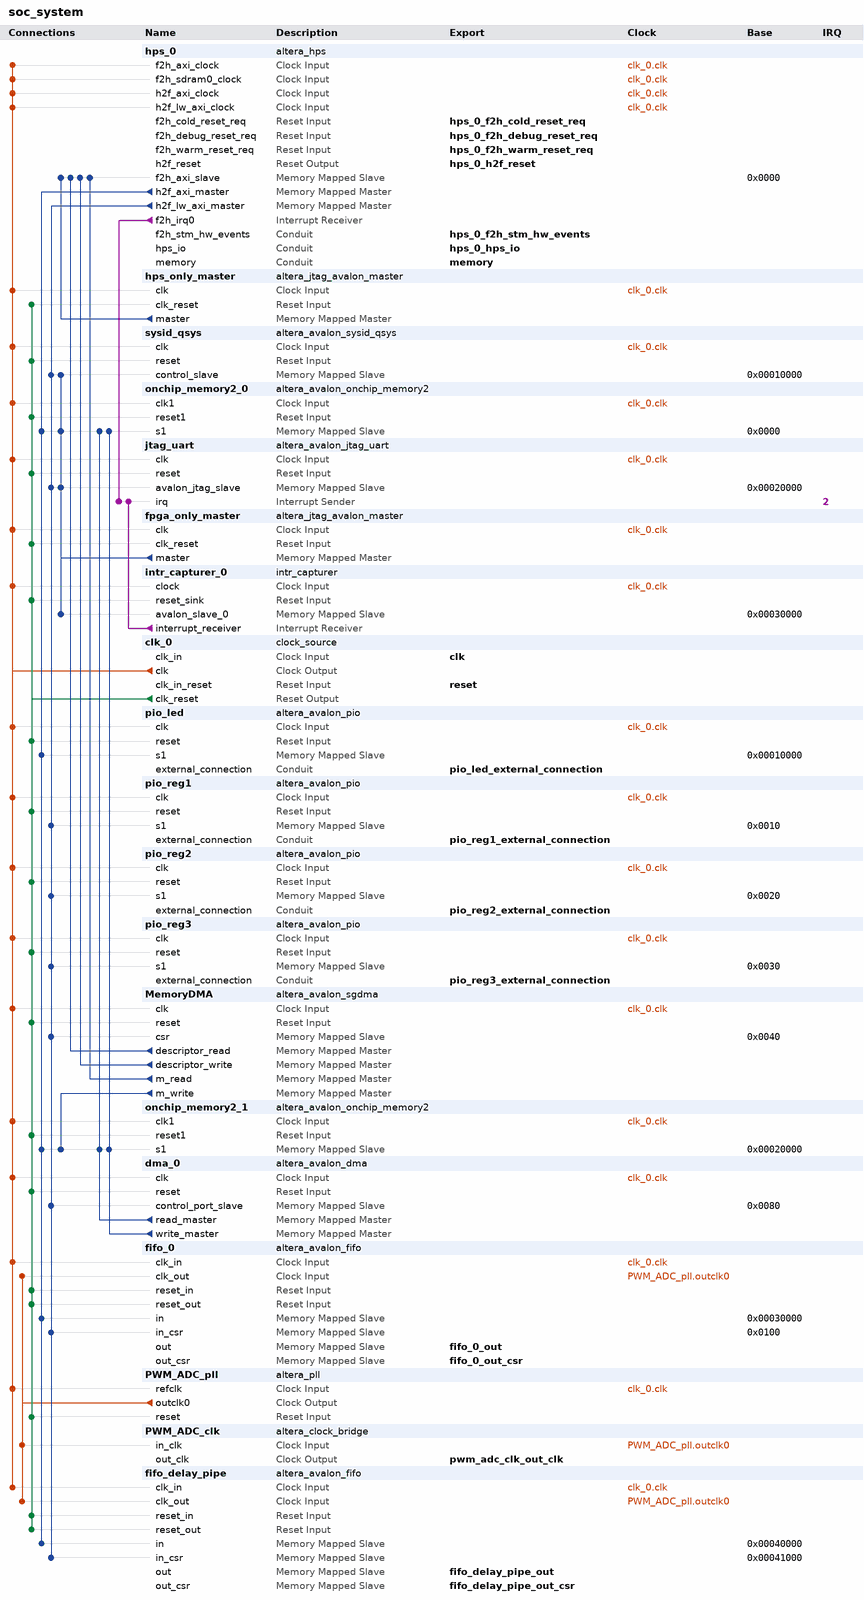
[diagram p0: system contents]
# Platform Designer (Qsys) system soc_system, Cyclone V 5CSEMA4U23C6
# Parameters at their usual value, and those the tool derives, are not listed.
package require -exact qsys 15.0
create_system soc_system
set_project_property DEVICE_FAMILY {Cyclone V}
set_project_property DEVICE 5CSEMA4U23C6

add_instance hps_0 altera_hps 15.0
set_instance_parameter_value hps_0 EMAC1_Mode RGMII
set_instance_parameter_value hps_0 EMAC1_PinMuxing {HPS I/O Set 0}
set_instance_parameter_value hps_0 F2SCLK_COLDRST_Enable true
set_instance_parameter_value hps_0 F2SCLK_DBGRST_Enable true
set_instance_parameter_value hps_0 F2SCLK_WARMRST_Enable true
set_instance_parameter_value hps_0 F2SDRAM_Type AXI-3
set_instance_parameter_value hps_0 F2SDRAM_Width 64
set_instance_parameter_value hps_0 F2SINTERRUPT_Enable true
set_instance_parameter_value hps_0 F2S_Width 2
set_instance_parameter_value hps_0 FPGA_PERIPHERAL_OUTPUT_CLOCK_FREQ_EMAC0_GTX_CLK 100
set_instance_parameter_value hps_0 FPGA_PERIPHERAL_OUTPUT_CLOCK_FREQ_EMAC0_MD_CLK 100.0
set_instance_parameter_value hps_0 FPGA_PERIPHERAL_OUTPUT_CLOCK_FREQ_EMAC1_GTX_CLK 100
set_instance_parameter_value hps_0 FPGA_PERIPHERAL_OUTPUT_CLOCK_FREQ_EMAC1_MD_CLK 100.0
set_instance_parameter_value hps_0 HPS_PROTOCOL DDR3
set_instance_parameter_value hps_0 I2C0_Mode I2C
set_instance_parameter_value hps_0 I2C0_PinMuxing {HPS I/O Set 0}
set_instance_parameter_value hps_0 I2C1_Mode I2C
set_instance_parameter_value hps_0 I2C1_PinMuxing {HPS I/O Set 0}
set_instance_parameter_value hps_0 LWH2F_Enable true
set_instance_parameter_value hps_0 MEM_BANKADDR_WIDTH 3
set_instance_parameter_value hps_0 MEM_CLK_FREQ 400.0
set_instance_parameter_value hps_0 MEM_COL_ADDR_WIDTH 10
set_instance_parameter_value hps_0 MEM_DQ_WIDTH 32
set_instance_parameter_value hps_0 MEM_DRV_STR RZQ/6
set_instance_parameter_value hps_0 MEM_ROW_ADDR_WIDTH 15
set_instance_parameter_value hps_0 MEM_RTT_NOM RZQ/6
set_instance_parameter_value hps_0 MEM_RTT_WR {Dynamic ODT off}
set_instance_parameter_value hps_0 MEM_TCL 7
set_instance_parameter_value hps_0 MEM_TFAW_NS 37.5
set_instance_parameter_value hps_0 MEM_TRAS_NS 35.0
set_instance_parameter_value hps_0 MEM_TRCD_NS 13.75
set_instance_parameter_value hps_0 MEM_TRFC_NS 300.0
set_instance_parameter_value hps_0 MEM_TRP_NS 13.75
set_instance_parameter_value hps_0 MEM_VENDOR Other
set_instance_parameter_value hps_0 MEM_WTCL 7
set_instance_parameter_value hps_0 QSPI_Mode N/A
set_instance_parameter_value hps_0 QSPI_PinMuxing Unused
set_instance_parameter_value hps_0 REF_CLK_FREQ 25.0
set_instance_parameter_value hps_0 S2F_Width 2
set_instance_parameter_value hps_0 SDIO_Mode {4-bit Data}
set_instance_parameter_value hps_0 SDIO_PinMuxing {HPS I/O Set 0}
set_instance_parameter_value hps_0 SPIM1_Mode {Single Slave Select}
set_instance_parameter_value hps_0 SPIM1_PinMuxing {HPS I/O Set 0}
set_instance_parameter_value hps_0 STM_Enable true
set_instance_parameter_value hps_0 TIMING_BOARD_AC_SKEW 0.02
set_instance_parameter_value hps_0 TIMING_BOARD_AC_TO_CK_SKEW 0.0
set_instance_parameter_value hps_0 TIMING_BOARD_DQ_TO_DQS_SKEW 0.0
set_instance_parameter_value hps_0 TIMING_BOARD_MAX_CK_DELAY 0.6
set_instance_parameter_value hps_0 TIMING_BOARD_MAX_DQS_DELAY 0.6
set_instance_parameter_value hps_0 TIMING_BOARD_SKEW_BETWEEN_DQS 0.02
set_instance_parameter_value hps_0 TIMING_BOARD_SKEW_CKDQS_DIMM_MAX 0.01
set_instance_parameter_value hps_0 TIMING_BOARD_SKEW_CKDQS_DIMM_MIN -0.01
set_instance_parameter_value hps_0 TIMING_BOARD_SKEW_WITHIN_DQS 0.02
set_instance_parameter_value hps_0 TIMING_TDH 125
set_instance_parameter_value hps_0 TIMING_TDQSCK 400
set_instance_parameter_value hps_0 TIMING_TDQSQ 120
set_instance_parameter_value hps_0 TIMING_TDS 50
set_instance_parameter_value hps_0 TIMING_TIH 250
set_instance_parameter_value hps_0 TIMING_TIS 175
set_instance_parameter_value hps_0 TIMING_TQSH 0.38
set_instance_parameter_value hps_0 UART0_Mode {No Flow Control}
set_instance_parameter_value hps_0 UART0_PinMuxing {HPS I/O Set 0}
set_instance_parameter_value hps_0 USB1_Mode SDR
set_instance_parameter_value hps_0 USB1_PinMuxing {HPS I/O Set 0}
set_instance_parameter_value hps_0 desired_cfg_clk_mhz 100.0
set_instance_parameter_value hps_0 desired_qspi_clk_mhz 370.0

add_instance hps_only_master altera_jtag_avalon_master 15.0

add_instance sysid_qsys altera_avalon_sysid_qsys 15.0
set_instance_parameter_value sysid_qsys id -1395322110

add_instance onchip_memory2_0 altera_avalon_onchip_memory2 15.0
set_instance_parameter_value onchip_memory2_0 dataWidth 64
set_instance_parameter_value onchip_memory2_0 dualPort false
set_instance_parameter_value onchip_memory2_0 initMemContent true
set_instance_parameter_value onchip_memory2_0 initializationFileName onchip_memory2_0
set_instance_parameter_value onchip_memory2_0 memorySize 65536

add_instance jtag_uart altera_avalon_jtag_uart 15.0
set_instance_parameter_value jtag_uart allowMultipleConnections true
set_instance_parameter_value jtag_uart simInteractiveOptions INTERACTIVE_ASCII_OUTPUT

add_instance fpga_only_master altera_jtag_avalon_master 15.0

add_instance intr_capturer_0 intr_capturer 100.99.98.97

add_instance clk_0 clock_source 15.0
set_instance_parameter_value clk_0 clockFrequency 50000000

add_instance pio_led altera_avalon_pio 15.0
set_instance_parameter_value pio_led direction Output
set_instance_parameter_value pio_led resetValue 255
set_instance_parameter_value pio_led width 8

add_instance pio_reg1 altera_avalon_pio 15.0
set_instance_parameter_value pio_reg1 direction Output
set_instance_parameter_value pio_reg1 resetValue 255
set_instance_parameter_value pio_reg1 width 8

add_instance pio_reg2 altera_avalon_pio 15.0
set_instance_parameter_value pio_reg2 direction Output
set_instance_parameter_value pio_reg2 resetValue 255
set_instance_parameter_value pio_reg2 width 8

add_instance pio_reg3 altera_avalon_pio 15.0
set_instance_parameter_value pio_reg3 direction Input
set_instance_parameter_value pio_reg3 width 8

add_instance MemoryDMA altera_avalon_sgdma 15.0
set_instance_parameter_value MemoryDMA enableBurstTransfers false
set_instance_parameter_value MemoryDMA enableUnalignedTransfers false
set_instance_parameter_value MemoryDMA readBlockDataWidth 32
set_instance_parameter_value MemoryDMA sinkErrorWidth 0
set_instance_parameter_value MemoryDMA sourceErrorWidth 0
set_instance_parameter_value MemoryDMA transferMode MEMORY_TO_MEMORY
set_instance_parameter_value MemoryDMA writeBurstcountWidth 4

add_instance onchip_memory2_1 altera_avalon_onchip_memory2 15.0
set_instance_parameter_value onchip_memory2_1 dataWidth 64
set_instance_parameter_value onchip_memory2_1 dualPort false
set_instance_parameter_value onchip_memory2_1 initMemContent true
set_instance_parameter_value onchip_memory2_1 initializationFileName onchip_mem.hex
set_instance_parameter_value onchip_memory2_1 memorySize 65536

add_instance dma_0 altera_avalon_dma 15.0
set_instance_parameter_value dma_0 allowByteTransactions true
set_instance_parameter_value dma_0 allowDoubleWordTransactions true
set_instance_parameter_value dma_0 allowHalfWordTransactions true
set_instance_parameter_value dma_0 allowQuadWordTransactions true
set_instance_parameter_value dma_0 burstEnable false
set_instance_parameter_value dma_0 fifoDepth 32
set_instance_parameter_value dma_0 maxBurstSize 128
set_instance_parameter_value dma_0 minimumDmaTransactionRegisterWidth 13

add_instance fifo_0 altera_avalon_fifo 15.0
set_instance_parameter_value fifo_0 bitsPerSymbol 16
set_instance_parameter_value fifo_0 channelWidth 8
set_instance_parameter_value fifo_0 errorWidth 8
set_instance_parameter_value fifo_0 fifoDepth 4096
set_instance_parameter_value fifo_0 fifoInputInterfaceOptions AVALONMM_WRITE
set_instance_parameter_value fifo_0 fifoOutputInterfaceOptions AVALONMM_READ
set_instance_parameter_value fifo_0 singleClockMode false
set_instance_parameter_value fifo_0 symbolsPerBeat 2
set_instance_parameter_value fifo_0 useIRQ false
set_instance_parameter_value fifo_0 usePacket true
set_instance_parameter_value fifo_0 useReadControl true

add_instance PWM_ADC_pll altera_pll 15.0
set_instance_parameter_value PWM_ADC_pll gui_device_speed_grade 1
set_instance_parameter_value PWM_ADC_pll gui_number_of_clocks 1
set_instance_parameter_value PWM_ADC_pll gui_operation_mode normal
set_instance_parameter_value PWM_ADC_pll gui_output_clock_frequency0 100.0
set_instance_parameter_value PWM_ADC_pll gui_pll_mode {Integer-N PLL}
set_instance_parameter_value PWM_ADC_pll gui_reference_clock_frequency 50.0
set_instance_parameter_value PWM_ADC_pll gui_use_locked false

add_instance PWM_ADC_clk altera_clock_bridge 15.0
set_instance_parameter_value PWM_ADC_clk DERIVED_CLOCK_RATE 100000000
set_instance_parameter_value PWM_ADC_clk EXPLICIT_CLOCK_RATE 0

add_instance fifo_delay_pipe altera_avalon_fifo 15.0
set_instance_parameter_value fifo_delay_pipe bitsPerSymbol 16
set_instance_parameter_value fifo_delay_pipe channelWidth 8
set_instance_parameter_value fifo_delay_pipe errorWidth 8
set_instance_parameter_value fifo_delay_pipe fifoDepth 256
set_instance_parameter_value fifo_delay_pipe fifoInputInterfaceOptions AVALONMM_WRITE
set_instance_parameter_value fifo_delay_pipe fifoOutputInterfaceOptions AVALONMM_READ
set_instance_parameter_value fifo_delay_pipe singleClockMode false
set_instance_parameter_value fifo_delay_pipe symbolsPerBeat 2
set_instance_parameter_value fifo_delay_pipe useIRQ false
set_instance_parameter_value fifo_delay_pipe usePacket true
set_instance_parameter_value fifo_delay_pipe useReadControl true

# connections
add_connection clk_0.clk dma_0.clk clock
add_connection clk_0.clk fifo_0.clk_in clock
add_connection clk_0.clk fifo_delay_pipe.clk_in clock
add_connection clk_0.clk fpga_only_master.clk clock
add_connection clk_0.clk hps_0.f2h_axi_clock clock
add_connection clk_0.clk hps_0.f2h_sdram0_clock clock
add_connection clk_0.clk hps_0.h2f_axi_clock clock
add_connection clk_0.clk hps_0.h2f_lw_axi_clock clock
add_connection clk_0.clk hps_only_master.clk clock
add_connection clk_0.clk intr_capturer_0.clock clock
add_connection clk_0.clk jtag_uart.clk clock
add_connection clk_0.clk MemoryDMA.clk clock
add_connection clk_0.clk onchip_memory2_0.clk1 clock
add_connection clk_0.clk onchip_memory2_1.clk1 clock
add_connection clk_0.clk pio_led.clk clock
add_connection clk_0.clk pio_reg1.clk clock
add_connection clk_0.clk pio_reg2.clk clock
add_connection clk_0.clk pio_reg3.clk clock
add_connection clk_0.clk PWM_ADC_pll.refclk clock
add_connection clk_0.clk sysid_qsys.clk clock
add_connection PWM_ADC_pll.outclk0 fifo_0.clk_out clock
add_connection PWM_ADC_pll.outclk0 fifo_delay_pipe.clk_out clock
add_connection PWM_ADC_pll.outclk0 PWM_ADC_clk.in_clk clock
add_connection clk_0.clk_reset dma_0.reset reset
add_connection clk_0.clk_reset fifo_0.reset_in reset
add_connection clk_0.clk_reset fifo_0.reset_out reset
add_connection clk_0.clk_reset fifo_delay_pipe.reset_in reset
add_connection clk_0.clk_reset fifo_delay_pipe.reset_out reset
add_connection clk_0.clk_reset fpga_only_master.clk_reset reset
add_connection clk_0.clk_reset hps_only_master.clk_reset reset
add_connection clk_0.clk_reset intr_capturer_0.reset_sink reset
add_connection clk_0.clk_reset jtag_uart.reset reset
add_connection clk_0.clk_reset MemoryDMA.reset reset
add_connection clk_0.clk_reset onchip_memory2_0.reset1 reset
add_connection clk_0.clk_reset onchip_memory2_1.reset1 reset
add_connection clk_0.clk_reset pio_led.reset reset
add_connection clk_0.clk_reset pio_reg1.reset reset
add_connection clk_0.clk_reset pio_reg2.reset reset
add_connection clk_0.clk_reset pio_reg3.reset reset
add_connection clk_0.clk_reset PWM_ADC_pll.reset reset
add_connection clk_0.clk_reset sysid_qsys.reset reset
add_connection dma_0.read_master onchip_memory2_0.s1 avalon
set_connection_parameter_value dma_0.read_master/onchip_memory2_0.s1 baseAddress 0x0000
add_connection dma_0.read_master onchip_memory2_1.s1 avalon
set_connection_parameter_value dma_0.read_master/onchip_memory2_1.s1 baseAddress 0x00020000
add_connection dma_0.write_master onchip_memory2_0.s1 avalon
set_connection_parameter_value dma_0.write_master/onchip_memory2_0.s1 baseAddress 0x0000
add_connection dma_0.write_master onchip_memory2_1.s1 avalon
set_connection_parameter_value dma_0.write_master/onchip_memory2_1.s1 baseAddress 0x00020000
add_connection fpga_only_master.master intr_capturer_0.avalon_slave_0 avalon
set_connection_parameter_value fpga_only_master.master/intr_capturer_0.avalon_slave_0 baseAddress 0x00030000
add_connection fpga_only_master.master jtag_uart.avalon_jtag_slave avalon
set_connection_parameter_value fpga_only_master.master/jtag_uart.avalon_jtag_slave baseAddress 0x00020000
add_connection fpga_only_master.master onchip_memory2_0.s1 avalon
set_connection_parameter_value fpga_only_master.master/onchip_memory2_0.s1 baseAddress 0x0000
add_connection fpga_only_master.master sysid_qsys.control_slave avalon
set_connection_parameter_value fpga_only_master.master/sysid_qsys.control_slave baseAddress 0x00010000
add_connection hps_0.h2f_axi_master fifo_0.in avalon
set_connection_parameter_value hps_0.h2f_axi_master/fifo_0.in baseAddress 0x00030000
add_connection hps_0.h2f_axi_master fifo_delay_pipe.in avalon
set_connection_parameter_value hps_0.h2f_axi_master/fifo_delay_pipe.in baseAddress 0x00040000
add_connection hps_0.h2f_axi_master onchip_memory2_0.s1 avalon
set_connection_parameter_value hps_0.h2f_axi_master/onchip_memory2_0.s1 baseAddress 0x0000
add_connection hps_0.h2f_axi_master onchip_memory2_1.s1 avalon
set_connection_parameter_value hps_0.h2f_axi_master/onchip_memory2_1.s1 baseAddress 0x00020000
add_connection hps_0.h2f_axi_master pio_led.s1 avalon
set_connection_parameter_value hps_0.h2f_axi_master/pio_led.s1 baseAddress 0x00010000
add_connection hps_0.h2f_lw_axi_master dma_0.control_port_slave avalon
set_connection_parameter_value hps_0.h2f_lw_axi_master/dma_0.control_port_slave baseAddress 0x0080
add_connection hps_0.h2f_lw_axi_master fifo_0.in_csr avalon
set_connection_parameter_value hps_0.h2f_lw_axi_master/fifo_0.in_csr baseAddress 0x0100
add_connection hps_0.h2f_lw_axi_master fifo_delay_pipe.in_csr avalon
set_connection_parameter_value hps_0.h2f_lw_axi_master/fifo_delay_pipe.in_csr baseAddress 0x00041000
add_connection hps_0.h2f_lw_axi_master jtag_uart.avalon_jtag_slave avalon
set_connection_parameter_value hps_0.h2f_lw_axi_master/jtag_uart.avalon_jtag_slave baseAddress 0x00020000
add_connection hps_0.h2f_lw_axi_master MemoryDMA.csr avalon
set_connection_parameter_value hps_0.h2f_lw_axi_master/MemoryDMA.csr baseAddress 0x0040
add_connection hps_0.h2f_lw_axi_master pio_reg1.s1 avalon
set_connection_parameter_value hps_0.h2f_lw_axi_master/pio_reg1.s1 baseAddress 0x0010
add_connection hps_0.h2f_lw_axi_master pio_reg2.s1 avalon
set_connection_parameter_value hps_0.h2f_lw_axi_master/pio_reg2.s1 baseAddress 0x0020
add_connection hps_0.h2f_lw_axi_master pio_reg3.s1 avalon
set_connection_parameter_value hps_0.h2f_lw_axi_master/pio_reg3.s1 baseAddress 0x0030
add_connection hps_0.h2f_lw_axi_master sysid_qsys.control_slave avalon
set_connection_parameter_value hps_0.h2f_lw_axi_master/sysid_qsys.control_slave baseAddress 0x00010000
add_connection hps_only_master.master hps_0.f2h_axi_slave avalon
set_connection_parameter_value hps_only_master.master/hps_0.f2h_axi_slave baseAddress 0x0000
add_connection MemoryDMA.descriptor_read hps_0.f2h_axi_slave avalon
set_connection_parameter_value MemoryDMA.descriptor_read/hps_0.f2h_axi_slave baseAddress 0x0000
add_connection MemoryDMA.descriptor_write hps_0.f2h_axi_slave avalon
set_connection_parameter_value MemoryDMA.descriptor_write/hps_0.f2h_axi_slave baseAddress 0x0000
add_connection MemoryDMA.m_read hps_0.f2h_axi_slave avalon
set_connection_parameter_value MemoryDMA.m_read/hps_0.f2h_axi_slave baseAddress 0x0000
add_connection MemoryDMA.m_write onchip_memory2_1.s1 avalon
set_connection_parameter_value MemoryDMA.m_write/onchip_memory2_1.s1 baseAddress 0x00020000
add_connection hps_0.f2h_irq0 jtag_uart.irq interrupt
set_connection_parameter_value hps_0.f2h_irq0/jtag_uart.irq irqNumber 2
add_connection intr_capturer_0.interrupt_receiver jtag_uart.irq interrupt
set_connection_parameter_value intr_capturer_0.interrupt_receiver/jtag_uart.irq irqNumber 2

# exported interfaces
add_interface clk clock sink
set_interface_property clk EXPORT_OF clk_0.clk_in
add_interface fifo_0_out avalon slave
set_interface_property fifo_0_out EXPORT_OF fifo_0.out
add_interface fifo_0_out_csr avalon slave
set_interface_property fifo_0_out_csr EXPORT_OF fifo_0.out_csr
add_interface fifo_delay_pipe_out avalon slave
set_interface_property fifo_delay_pipe_out EXPORT_OF fifo_delay_pipe.out
add_interface fifo_delay_pipe_out_csr avalon slave
set_interface_property fifo_delay_pipe_out_csr EXPORT_OF fifo_delay_pipe.out_csr
add_interface hps_0_f2h_cold_reset_req reset sink
set_interface_property hps_0_f2h_cold_reset_req EXPORT_OF hps_0.f2h_cold_reset_req
add_interface hps_0_f2h_debug_reset_req reset sink
set_interface_property hps_0_f2h_debug_reset_req EXPORT_OF hps_0.f2h_debug_reset_req
add_interface hps_0_f2h_stm_hw_events conduit end
set_interface_property hps_0_f2h_stm_hw_events EXPORT_OF hps_0.f2h_stm_hw_events
add_interface hps_0_f2h_warm_reset_req reset sink
set_interface_property hps_0_f2h_warm_reset_req EXPORT_OF hps_0.f2h_warm_reset_req
add_interface hps_0_h2f_reset reset source
set_interface_property hps_0_h2f_reset EXPORT_OF hps_0.h2f_reset
add_interface hps_0_hps_io conduit end
set_interface_property hps_0_hps_io EXPORT_OF hps_0.hps_io
add_interface memory conduit end
set_interface_property memory EXPORT_OF hps_0.memory
add_interface pio_led_external_connection conduit end
set_interface_property pio_led_external_connection EXPORT_OF pio_led.external_connection
add_interface pio_reg1_external_connection conduit end
set_interface_property pio_reg1_external_connection EXPORT_OF pio_reg1.external_connection
add_interface pio_reg2_external_connection conduit end
set_interface_property pio_reg2_external_connection EXPORT_OF pio_reg2.external_connection
add_interface pio_reg3_external_connection conduit end
set_interface_property pio_reg3_external_connection EXPORT_OF pio_reg3.external_connection
add_interface pwm_adc_clk_out_clk clock source
set_interface_property pwm_adc_clk_out_clk EXPORT_OF PWM_ADC_clk.out_clk
add_interface reset reset sink
set_interface_property reset EXPORT_OF clk_0.clk_in_reset

set_interconnect_requirement {$system} qsys_mm.clockCrossingAdapter HANDSHAKE
set_interconnect_requirement {$system} qsys_mm.maxAdditionalLatency 1

save_system soc_system.qsys
